# EAGLE schematic VAM control logic proposal_4.5 (EAGLE 7.2.0)
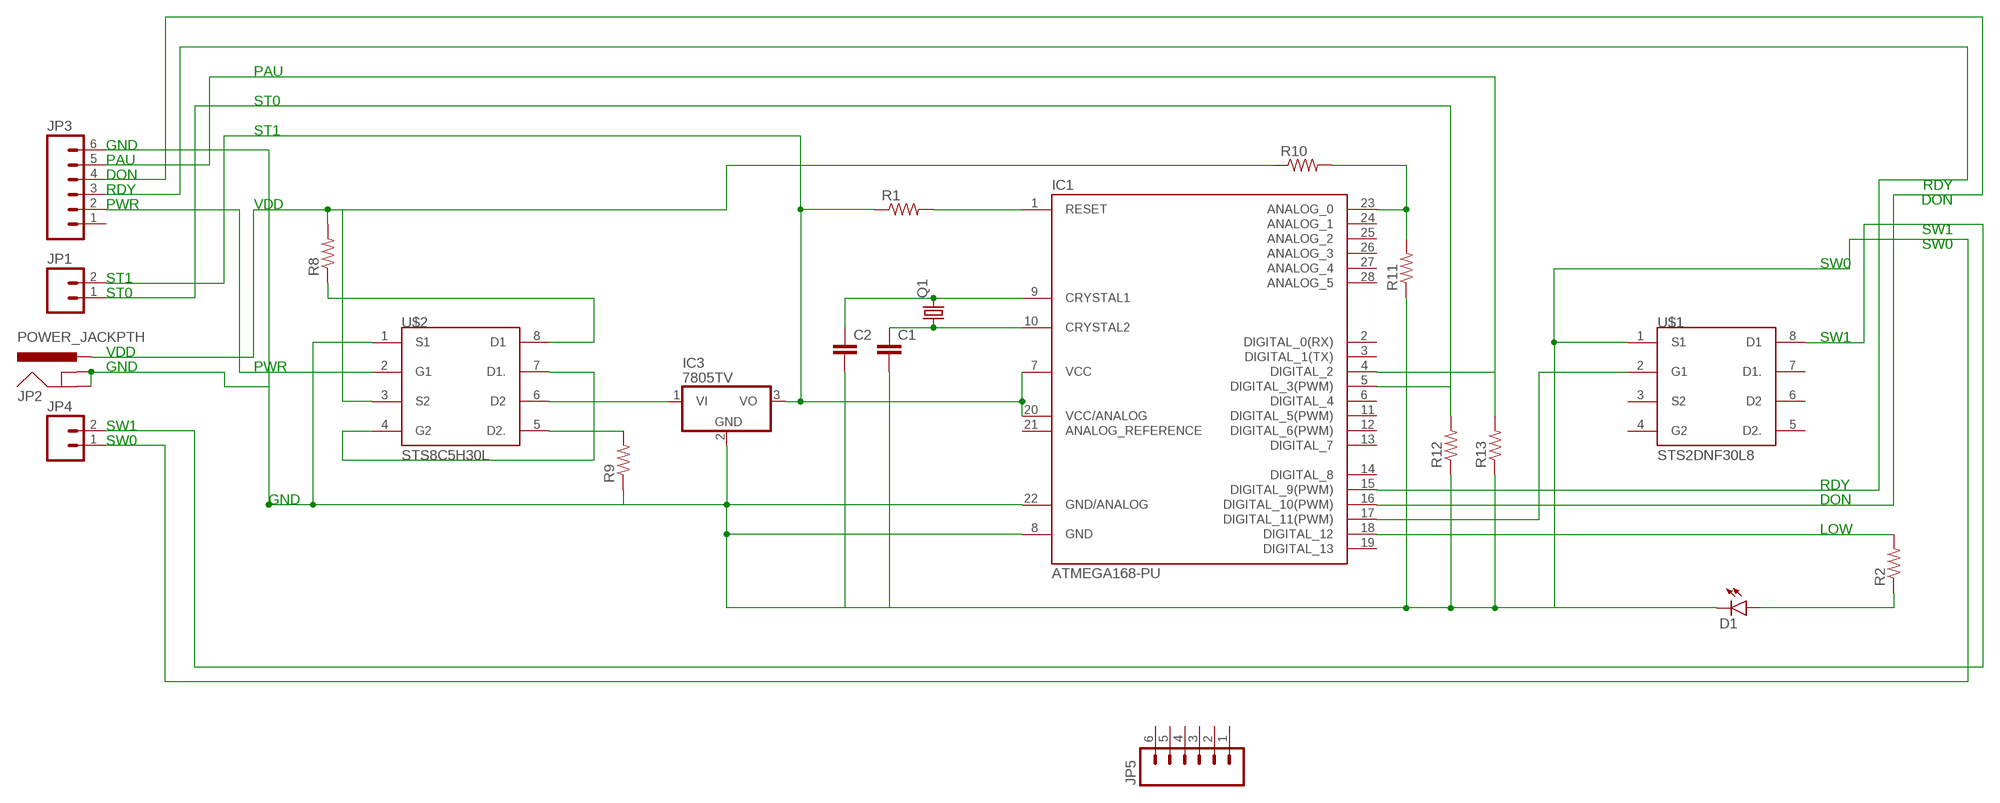
[diagram p0: schematic, sheet 1]

## Parts
C1  C-EU025-024X044  [C025-024X044]
C2  C-EU025-024X044  [C025-024X044]
D1  LED5MM  [LED5MM]
IC1  ATMEGA168-PU  [DIL28-3]
IC3  7805TV  [TO220V]
JP1  M02PTH  [1X02]
JP2  POWER_JACKPTH  [POWER_JACK_PTH]
JP3  M06SILK_FEMALE_PTH  [1X06]
JP4  M02PTH  [1X02]
JP5  M06SILK_FEMALE_PTH  [1X06]
Q1  CRYSTALHC49U-V  [HC49U-V]
R1  R-US_R1206  [R1206]
R2  R-US_R1206  [R1206]
R8  R-US_R1206  [R1206]
R9  R-US_R1206  [R1206]
R10  R-US_R1206  [R1206]
R11  R-US_R1206  [R1206]
R12  R-US_R1206  [R1206]
R13  R-US_R1206  [R1206]
U$1  STS2DNF30L8  [SOIC-8]
U$2  STS8C5H30L  STS2DNF30L8  [SOIC-8]

## Nets
N$1: JP3.2 U$2.2(G1)
N$2: IC1.1(RESET) R1.2
N$3: R8.1 U$2.8(D1)
N$4: R9.2 U$2.5(D2.)
N$5: C2.1 IC1.9(CRYSTAL1) Q1.2
N$6: IC3.1(VI) U$2.6(D2)
N$7: C1.1 IC1.10(CRYSTAL2) Q1.1
N$8: IC1.7(VCC) IC1.20(VCC/ANALOG) IC3.3(VO) JP1.2 R1.1
N$9: IC1.23(ANALOG_0) R10.2 R11.2
N$10: IC1.5(DIGITAL_3(PWM)) JP1.1 R12.2
N$11: U$2.4(G2) U$2.7(D1.)
N$12: C1.2 C2.2 D1.K(C) IC1.8(GND) IC1.22(GND/ANALOG) IC3.2(GND) JP2.GND JP2.GNDBREAK JP3.6 JP4.1 R9.1 R11.1 R12.1 R13.1 U$1.1(S1) U$2.1(S1)
N$13: IC1.16(DIGITAL_10(PWM)) JP3.4
N$14: IC1.4(DIGITAL_2) JP3.5 R13.2
N$15: IC1.15(DIGITAL_9(PWM)) JP3.3
N$16: IC1.18(DIGITAL_12) R2.2
N$17: JP2.PWR R8.2 R10.1 U$2.3(S2)
N$18: D1.A R2.1
N$22: IC1.17(DIGITAL_11(PWM)) U$1.2(G1)
N$24: JP4.2 U$1.8(D1)
Unconnected: IC1.2(DIGITAL_0(RX)) IC1.3(DIGITAL_1(TX)) IC1.6(DIGITAL_4) IC1.11(DIGITAL_5(PWM)) IC1.12(DIGITAL_6(PWM)) IC1.13(DIGITAL_7) IC1.14(DIGITAL_8) IC1.19(DIGITAL_13) IC1.21(ANALOG_REFERENCE) IC1.24(ANALOG_1) IC1.25(ANALOG_2) IC1.26(ANALOG_3) IC1.27(ANALOG_4) IC1.28(ANALOG_5) JP3.1 JP5.1 JP5.2 JP5.3 JP5.4 JP5.5 JP5.6 U$1.3(S2) U$1.4(G2) U$1.5(D2.) U$1.6(D2) U$1.7(D1.)

## Notes on the sheet
- PAU
- ST0
- ST1
- GND
- PAU
- DON | RDY
- RDY | DON
- PWR | VDD
- SW1
- SW0
- SW0
- ST1
- ST0
- SW1
- VDD
- GND | PWR
- SW1
- SW0
- RDY
- GND | DON
- LOW

## Library data of the parts
C1 C2 = rcl:C-EU: CAPACITOR, European symbol
D1 = SparkFun-LED:LED: LEDs Standard schematic elements and footprints for 5mm, 3mm, 1206, and 0603 sized LEDs. 5mm - Spark Fun Electronics SKU : COM-00529 (and others)
IC1 = Arduino-AVR:ATMEGA168-PU
IC3 = linear:78*: Positive VOLTAGE REGULATOR Source: http://cache.national.com/ds/LM/LM78L05.pdf http://www.fairchildsemi.com/ds/LM/LM7805.pdf
JP1 JP4 = SparkFun-Connectors:M02: Standard 2-pin 0.1" header. Use with - straight break away headers ( PRT-00116) - right angle break away headers (PRT-00553) - swiss pins (PRT-00743) - machine pins (PRT-00117) - female headers (PRT-00115) Molex polarized connector foot print use with: PRT-08233 with associated crimp pins and housings. 2.54_SCREWTERM for use with PRT-10571. 3.5mm Screw Terminal footprints for PRT-08084 5mm Screw Terminal footprints for use with PRT-08432
JP2 = SparkFun-Connectors:POWER_JACK: Power Jack This is the standard 5.5mm barrel jack for power. The PTH is the most common, proven, reliable, footprint. The Slot footprint only works if the mill layer is transmitted to the PCB fab house so be warned. Mating wall wart : TOL-00298 (and others); PROD_ID: CONN-08197
JP3 JP5 = SparkFun-Connectors:M06: Header 6 Standard 6-pin 0.1" header. Use with straight break away headers (SKU : PRT-00116), right angle break away headers (PRT-00553), swiss pins (PRT-00743), machine pins (PRT-00117), and female headers (PRT-00115). Molex polarized connector foot print use with SKU : PRT-08094 with associated crimp pins and housings. NOTES ON THE VARIANTS LOCK and LOCK_LONGPADS... This footprint was designed to help hold the alignment of a through-hole component (i.e. 6-pin header) while soldering it into place. You may notice that each hole has been shifted either up or down by 0.005 of an inch from it's more standard position (which is a perfectly straight line). This slight alteration caused the pins (the squares in the middle) to touch the edges of the holes. Because they are alternating, it causes a "brace" to hold the component in place. 0.005 has proven to be the perfect amount of "off-center" position when using our standard breakaway headers. Although looks a little odd when you look at the bare footprint, once you have a header in there, the alteration is very hard to notice. Also,if you push a header all the way into place, it is covered up entirely on the bottom side. This idea of altering the position of holes to aid alignment will be further integrated into the Sparkfun Library for other footprints. It can help hold any component with 3 or more connection pins.; PROD_ID: CONN-08437
Q1 = crystal:CRYSTAL: CRYSTAL; OC_FARNELL: 1666969; OC_NEWARK: unknown
R1 R2 R8-R13 = rcl:R-US_: RESISTOR, American symbol
U$1 U$2 = Custom:STS2DNF30L